# EAGLE board AQ_sensor_GSM (EAGLE 9.6.2)
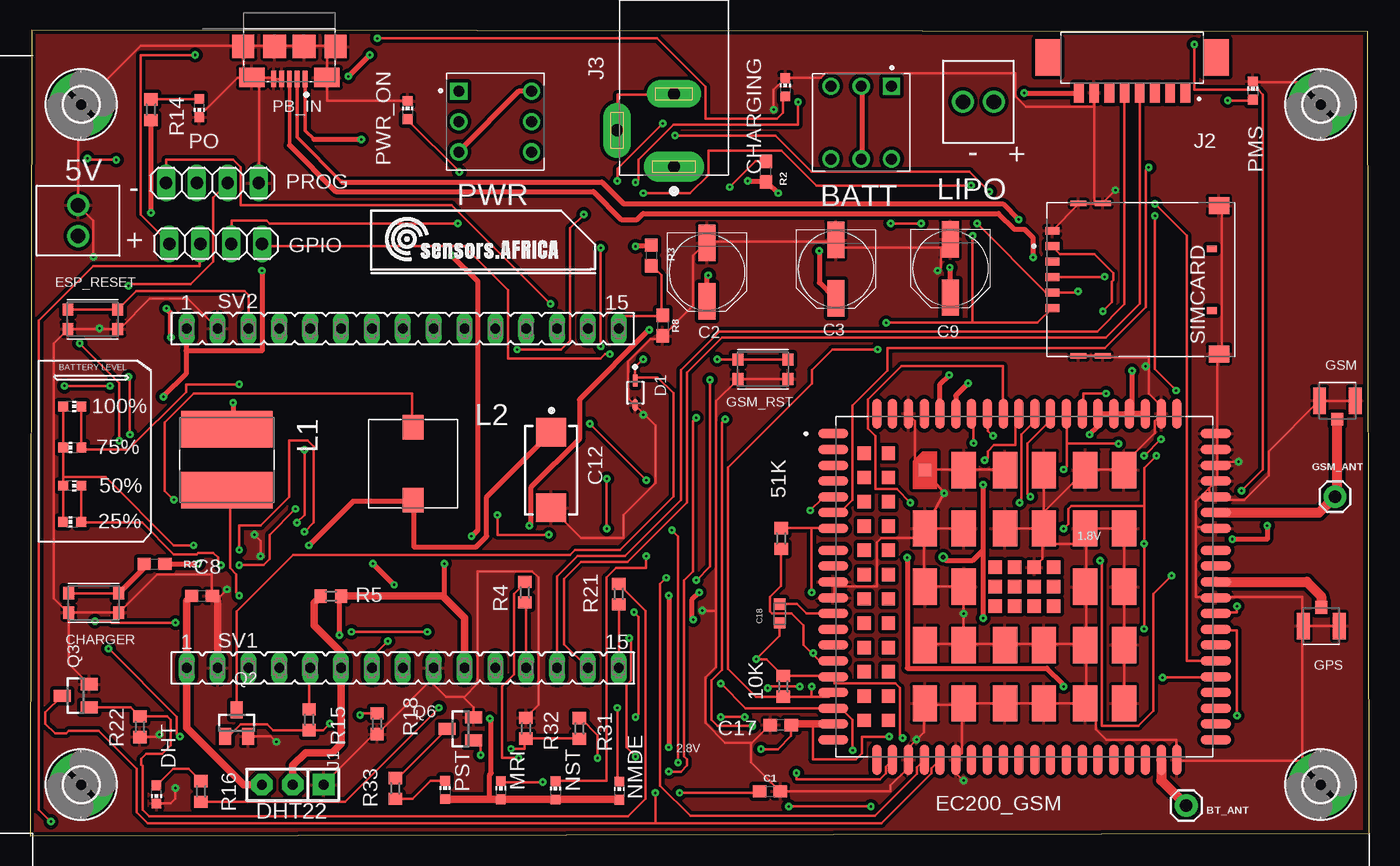
[diagram p5: board, top side]
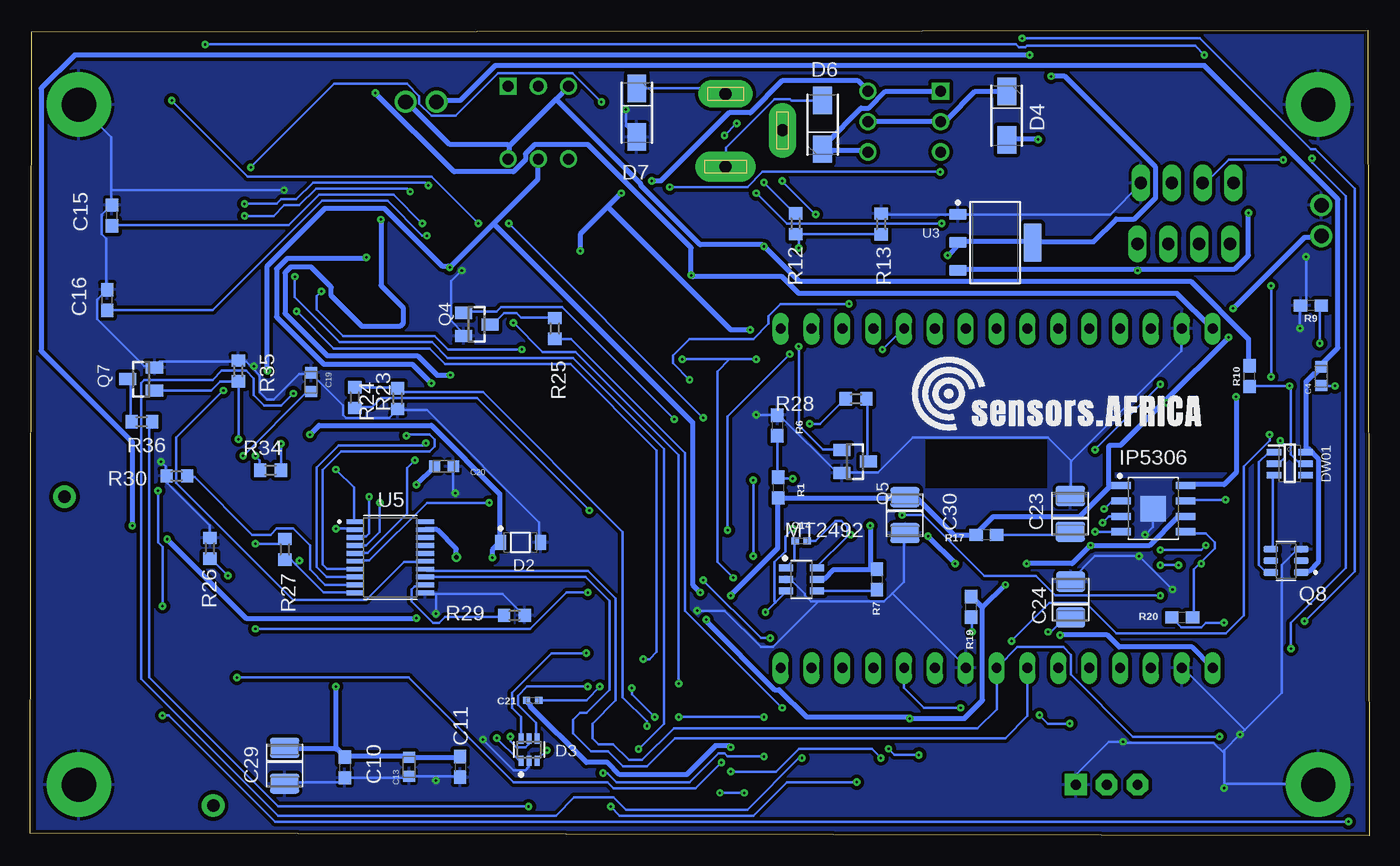
[diagram p6: board, bottom side, seen from below]

Size 110.2 x 66.3 mm. Coordinates in mm from the lower left corner, seen from the top.
Outline: 110.1,66.2 0.1,66.3 0,0 110.2,0.2 110.1,66.2
Copper layers (1*16): Top 0.035mm / dielectric 1.5mm / Bottom 0.035mm
Design rules "default *": minimum track width 0.1mm, minimum drill 0.15mm, track to track 0.3mm, track to pad 0.1mm, pad to pad 0.2mm, via to via 0.3mm, smd to smd 0.3mm, copper to edge 0.3mm, drill to drill 0.3mm, minimum pad ring 10mil, minimum via ring 8mil, stop-mask expansion 4mil, vias tented up to drill 0mil, thermal gap 10mil
Net classes: 0 default: width 0.2 mm, drill 0.2 mm, clearance 0.2 mm; 1 POWER: width 0.4 mm, drill 0.2 mm, clearance 0.2 mm to class 0, clearance 0.2 mm; 2 BGA: width 0.2 mm, drill 0.2 mm; 3 HCurrent: width 0.4 mm, drill 0.2 mm, clearance 0.2 mm to class 0

## Footprints (pad centres in the part's own frame; a part is rotated, then mirrored left to right if it is on the bottom)
TERMBLK_254-2N = drill 1.2: 1 0,0; 2 2.54,0
R0603 = smd 1 x 1.1: 1 -0.85,0; 2 0.85,0
CHIP-LED0603 = smd 0.8 x 0.8: A 0,-0.75; C 0,0.75
SW_TL2285EE = drill 0.9 square: 1 -2.5,-3 | drill 0.9: 2 0,-3; 3 2.5,-3; 4 -2.5,3; 5 0,3; 6 2.5,3
1X01 = drill 1.016 pad 1.88: 1 0,0
0603 = smd 1.1 x 1: 1 -0.85,0; 2 0.85,0
PANASONIC_D = smd 3 x 1.4: + 2.4,0; - -2.4,0
CAPC1608X90N = smd 0.92 x 0.98: 1 -0.775,0; 2 0.775,0
C0603 = smd 1.1 x 1: 1 -0.85,0; 2 0.85,0
CAPMP7343X430N = smd 2.35 x 2.45: 1 -3.1,0; 2 3.1,0
0402-TIGHT = smd 0.6 x 0.6: 1 -0.5,0; 2 0.5,0
CAP_TANT_B = smd 1.66 x 2.42: 1 -1.475,0; 2 1.475,0
SW_KMR621NGLFS = smd 0.9 x 1: 1_1 -2.05,0.8; 1_2 2.05,0.8; 2_1 -2.05,-0.8; 2_2 2.05,-0.8
ON_SEMI_1N4148WS_0 = smd 1.006 x 0.392: 1 -1,0; 2 1,0
ON_SEMICONDUCTOR_MMSZ5231BT1G_0 = smd 0.91 x 1.22: 1 -1.635,0; 2 1.635,0
SEMTECH_SMF05C_0 = smd 0.85 x 0.4: 1 -0.925,0.65; 2 -0.925,0; 3 -0.925,-0.65; 4 0.925,-0.65; 5 0.925,0; 6 0.925,0.65
DIOM5025X220N = smd 2.25 x 1.55: 1 -2,0; 2 2,0
SOT23-6L = smd 0.55 x 1.2: 1 -0.95,-1.3; 2 0,-1.3; 3 0.95,-1.3; 4 0.95,1.3; 5 0,1.3; 6 -0.95,1.3
XCVR_EC200UCNAB-N05-SNNSA = smd 2.5 x 0.8: 1 -15.75,12.6; 2 -15.75,11.3; 3 -15.75,10; 4 -15.75,8.7; 5 -15.75,7.4; 6 -15.75,6.1; 7 -15.75,4.8; 8 -15.75,0.4; 9 -15.75,-0.9; 10 -15.75,-2.2; 11 -15.75,-3.5; 12 -15.75,-4.8; 13 -15.75,-6.1; 14 -15.75,-7.4; 15 -15.75,-8.7; 16 -15.75,-10; 17 -15.75,-11.3; 18 -15.75,-12.6; 37 15.75,-12.6; 38 15.75,-11.3; 39 15.75,-10; 40 15.75,-8.7; 41 15.75,-7.4; 42 15.75,-6.1; 43 15.75,-4.8; 44 15.75,-3.5; 45 15.75,-2.2; 46 15.75,-0.9; 47 15.75,0.4; 48 15.75,4.8; 49 15.75,6.1; 50 15.75,7.4; 51 15.75,8.7; 52 15.75,10; 53 15.75,11.3; 54 15.75,12.6; 141 -15.75,3; 142 -15.75,1.7; 143 15.75,1.7; 144 15.75,3 | smd 0.8 x 2.5: 19 -9.55,-14.25; 20 -8.25,-14.25; 21 -6.95,-14.25; 22 -5.65,-14.25; 23 -4.35,-14.25; 24 -3.05,-14.25; 25 -1.75,-14.25; 26 -0.45,-14.25; 27 0.85,-14.25; 28 2.15,-14.25; 29 3.45,-14.25; 30 4.75,-14.25; 31 6.05,-14.25; 32 7.35,-14.25; 33 8.65,-14.25; 34 9.95,-14.25; 35 11.25,-14.25; 36 12.55,-14.25; 55 12.55,14.25; 56 11.25,14.25; 57 9.95,14.25; 58 8.65,14.25; 59 7.35,14.25; 60 6.05,14.25; 61 4.75,14.25; 62 3.45,14.25; 63 2.15,14.25; 64 0.85,14.25; 65 -0.45,14.25; 66 -1.75,14.25; 67 -3.05,14.25; 68 -4.35,14.25; 69 -5.65,14.25; 70 -6.95,14.25; 71 -8.25,14.25; 72 -9.55,14.25; 113 -10.85,14.25; 114 -12.15,14.25; 115 -10.85,-14.25; 116 -12.15,-14.25 | smd 1.1 x 1.1: 73 2.4,1.6; 74 2.4,0; 75 2.4,-1.6; 76 0.8,1.6; 77 0.8,0; 78 0.8,-1.6; 79 -0.8,1.6; 80 -0.8,0; 81 -0.8,-1.6; 82 -2.4,1.6; 83 -2.4,0; 84 -2.4,-1.6; 117 -11.2,11; 118 -11.2,9; 119 -11.2,7; 120 -11.2,5; 121 -11.2,3; 122 -11.2,1; 123 -11.2,-1; 124 -11.2,-3; 125 -11.2,-5; 126 -11.2,-7; 127 -11.2,-9; 128 -11.2,-11; 129 -13.2,11; 130 -13.2,9; 131 -13.2,7; 132 -13.2,5; 133 -13.2,3; 134 -13.2,1; 135 -13.2,-1; 136 -13.2,-3; 137 -13.2,-5; 138 -13.2,-7; 139 -13.2,-9; 140 -13.2,-11 | smd 2 x 3: 85 8.2,9.6; 86 8.2,4.8; 87 8.2,0; 88 8.2,-4.8; 89 8.2,-9.6; 90 5,9.6; 91 5,4.8; 92 5,0; 93 5,-4.8; 94 5,-9.6; 95 1.6,9.6; 96 1.6,4.8; 97 1.6,-4.8; 98 1.6,-9.6; 99 -1.6,9.6; 100 -1.6,4.8; 101 -1.6,-4.8; 102 -1.6,-9.6; 103 -5,9.6; 104 -5,4.8; 105 -5,0; 106 -5,-4.8; 107 -5,-9.6; 109 -8.2,4.8; 110 -8.2,0; 111 -8.2,-4.8; 112 -8.2,-9.6 | smd 1 x 1: 108 -8.2,9.6
1X04 = drill 1.016 long: 1 -3.81,0; 2 -1.27,0; 3 1.27,0; 4 3.81,0
TE_1909763-1 = smd 1 x 1.05: 1 0,-1.525 | smd 1.05 x 2.2: 2 -1.475,0; 3 1.475,0
2,8-PAD = drill 2.8 pad 5.334: B2,8 0,0
SOIC127P600X165-9T209N = smd 1.609 x 0.594: 1 -2.653,1.905; 2 -2.653,0.635; 3 -2.653,-0.635; 4 -2.653,-1.905; 5 2.653,-1.905; 6 2.653,-0.635; 7 2.653,0.635; 8 2.653,1.905 | smd 2.09 x 2.09: 9 0,0
SIP-100-03-32 = drill 0.813 pad 1.778 square: 1 -2.54,0 | drill 0.813 pad 1.778 octagon: 2 0,0; 3 2.54,0
MOLEX_53261-0871 = smd 0.8 x 1.6: 1 -4.375,2.9; 2 -3.125,2.9; 3 -1.875,2.9; 4 -0.625,2.9; 5 0.625,2.9; 6 1.875,2.9; 7 3.125,2.9; 8 4.375,2.9 | smd 2.1 x 3: S1 -6.925,0; S2 6.925,0
CUI_PJ-002BH = drill 1 pad 2.5 long: 1 0,0 | drill 1 pad 2.25 long: 2 6,0; 3 3,4.7
784787047 = smd 7.5 x 3: 1 0,2.5; 2 0,-2.5
784778010 = smd 1.7 x 2: 1 0,3; 2 0,-3
SOT95P280X145-6N = smd 1.172 x 0.589: 1 -1.272,0.95; 2 -1.272,0; 3 -1.272,-0.95; 4 1.272,-0.95; 5 1.272,0; 6 1.272,0.95
AMPHENOL_10118192-0001LF = smd 0.4 x 1.35: 1 -1.3,0; 2 -0.65,0; 3 0,0; 4 0.65,0; 5 1.3,0 | smd 2.1 x 1.6: SH1 -3.1,-0.125; SH2 3.1,-0.125 | smd 1.8 x 1.9: SH3 -3.8,-2.675; SH6 3.8,-2.675 | smd 1.9 x 1.9: SH4 -1.2,-2.675; SH5 1.2,-2.675
SOT23-BEC = smd 1 x 1.4: B -0.95,-1.1; C 0,1.1; E 0.95,-1.1
SOT95P280X145-6N' = smd 1.21 x 0.59: 1 -1.255,0.95; 2 -1.255,0; 3 -1.255,-0.95; 4 1.255,-0.95; 5 1.255,0; 6 1.255,0.95
MOLEX_78646-3001 = smd 1.15 x 0.65: C1 -7.295,2.755; C2 -7.295,0.215; C3 -7.295,-2.325; C5 -7.295,4.025; C6 -7.295,1.485; C7 -7.295,-1.055 | smd 1.3 x 0.45: G1 -5.125,6.27; G2 -3.125,6.27; G3 -5.125,-6.27; G4 -3.125,-6.27 | smd 1.7 x 1.4: G5 6.435,-6.105; G6 6.435,6.105 | smd 0.8 x 0.54: X1 5.855,2.54; X2 5.855,-2.54
FE15 = drill 0.813 long: 1 -17.78,0; 2 -15.24,0; 3 -12.7,0; 4 -10.16,0; 5 -7.62,0; 6 -5.08,0; 7 -2.54,0; 8 0,0; 9 2.54,0; 10 5.08,0; 11 7.62,0; 12 10.16,0; 13 12.7,0; 14 15.24,0; 15 17.78,0
TEXAS_INSTRUMENTS_LM1117IMP-3.3-NOPB_0 = smd 1.45 x 0.9: 1 -3.075,2.3; 2 -3.075,0; 3 -3.075,-2.3 | smd 1.45 x 3.15: 4 3.075,0
SOP65P640X120-20N = smd 1.57 x 0.41: 1 -2.87,2.925; 2 -2.87,2.275; 3 -2.87,1.625; 4 -2.87,0.975; 5 -2.87,0.325; 6 -2.87,-0.325; 7 -2.87,-0.975; 8 -2.87,-1.625; 9 -2.87,-2.275; 10 -2.87,-2.925; 11 2.87,-2.925; 12 2.87,-2.275; 13 2.87,-1.625; 14 2.87,-0.975; 15 2.87,-0.325; 16 2.87,0.325; 17 2.87,0.975; 18 2.87,1.625; 19 2.87,2.275; 20 2.87,2.925

## Placement (x,y rotation side)
5V  2828XX-2282834-2  [TERMBLK_254-2N]  3.93,49.37 90 top
10K  4.7K  [R0603]  61.97,12.29 90 top
25%  ORANGE  [CHIP-LED0603]  3.44,25.83 90 top
50%  ORANGE  [CHIP-LED0603]  3.46,28.8 270 top
51K  4.7K  [R0603]  61.79,24.46 90 top
75%  ORANGE  [CHIP-LED0603]  3.46,31.96 90 top
100%  ORANGE  [CHIP-LED0603]  3.46,35.34 270 top
BATT  TL2285EE  [SW_TL2285EE]  68.39,58.71 180 top
BT_ANT  [1X01]  95.14,2.48 180 top
C1  10nF  [0603]  60.88,3.64 0 top
C2  100uF  [PANASONIC_D]  55.68,46.39 270 top
C3  100uF  [PANASONIC_D]  66.3,46.65 270 top
C4  100nf  [CAPC1608X90N]  3.94,37.82 90 bottom
C8  10uF  [C0603]  14.13,19.74 0 top
C9  100uF  [PANASONIC_D]  75.72,46.7 270 top
C10  33pF  [C0603]  84.31,5.61 270 bottom
C11  10pF  [C0603]  74.82,5.66 270 bottom
C12  470uf  [CAPMP7343X430N]  42.85,30.1 270 top
C13  100nf  [CAPC1608X90N]  79.03,5.67 90 bottom
C14  22nF  [0402-TIGHT]  46.75,24.27 0 bottom
C15  33pF  [C0603]  103.49,51.07 90 bottom
C16  33pF  [C0603]  103.87,44.09 90 bottom
C17  33pF  [C0603]  61.77,9.1 180 top
C18  100nf  [CAPC1608X90N]  61.68,18.29 270 top
C19  100nf  [CAPC1608X90N]  87.08,37.33 270 bottom
C20  100nf  [CAPC1608X90N]  76.16,30.41 180 bottom
C21  22pF  [0402-TIGHT]  68.86,11.15 0 bottom
C23  TAJB106K016RNJ  [CAP_TANT_B]  24.6,26.49 90 bottom
C24  TAJB106K016RNJ  [CAP_TANT_B]  24.57,19.43 90 bottom
C29  TAJB106K016RNJ  [CAP_TANT_B]  89.27,5.75 270 bottom
C30  TAJB106K016RNJ  [CAP_TANT_B]  38.21,26.39 270 bottom
CHARGER  KMR621NGLFS  [SW_KMR621NGLFS]  5.22,19.16 0 top
CHARGING  ORANGE  [CHIP-LED0603]  62.14,61.62 0 top
D1  ON_SEMI_1N4148WSON_SEMI_1N4148WS_0_0  [ON_SEMI_1N4148WS_0]  49.79,36.47 270 top
D2  ON_SEMICONDUCTOR_MMSZ5231BT1GON_SEMICONDUCTOR_MMSZ5231BT1G_0_0  [ON_SEMICONDUCTOR_MMSZ5231BT1G_0]  69.86,24.14 0 bottom
D3  SEMTECH_SMF05CSEMTECH_SMF05C_0_0  [SEMTECH_SMF05C_0]  69.15,7.08 90 bottom
D4  SS54-HF  [DIOM5025X220N]  29.82,59.28 270 bottom
D6  SS54-HF  [DIOM5025X220N]  44.99,58.52 90 bottom
D7  SS54-HF  [DIOM5025X220N]  60.29,59.52 270 bottom
DHT  GREEN  [CHIP-LED0603]  10.39,3.4 180 top
DW01  DW01-P  [SOT23-6L]  6.54,30.62 270 bottom
EC200_GSM  EC200UCNAB-N05-SNNSA  [XCVR_EC200UCNAB-N05-SNNSA]  81.83,20.49 0 top
ESP_RESET  KMR621NGLFS  [SW_KMR621NGLFS]  5.14,42.52 180 top
GPIO  PINHD-1X4  [1X04]  15.25,48.73 0 top
GPS  1909763-1  [TE_1909763-1]  106.26,17.26 180 top
GSM  1909763-1  [TE_1909763-1]  107.59,35.81 0 top
GSM_ANT  [1X01]  107.39,27.9 180 top
GSM_RST  KMR621NGLFS  [SW_KMR621NGLFS]  60.31,38.4 180 top
H1  MOUNT-PAD-ROUND2.8  [2,8-PAD]  4.2,60.2 180 top
H2  MOUNT-PAD-ROUND2.8  [2,8-PAD]  4.2,4.2 180 top
H3  MOUNT-PAD-ROUND2.8  [2,8-PAD]  106.2,4.2 180 top
H4  MOUNT-PAD-ROUND2.8  [2,8-PAD]  106.2,60.2 180 top
IP5306  IP5306  [SOIC127P600X165-9T209N]  17.77,26.92 0 bottom
J1  F-1X03-SIP-100-32  [SIP-100-03-32]  21.6,4.2 180 top
J2  53261-0871  [MOLEX_53261-0871]  90.69,64.06 180 top
J3  PJ-002BH  [CUI_PJ-002BH]  52.98,55.07 90 top
L1  784787047  [784787047]  16.18,30.94 180 top
L2  784778010  [784778010]  31.51,30.62 0 top
LIPO  2828XX-2282834-2  [TERMBLK_254-2N]  79.31,60.42 180 top
MRI  ORANGE  [CHIP-LED0603]  38.73,3.75 0 top
MT2492  MT2492  [SOT95P280X145-6N]  46.73,21.1 0 bottom
NMDE  ORANGE  [CHIP-LED0603]  48.47,3.69 0 top
NST  ORANGE  [CHIP-LED0603]  43.22,3.73 0 top
PB_IN  10118192-0001LF  [AMPHENOL_10118192-0001LF]  21.32,62.3 180 top
PMS  ORANGE  [CHIP-LED0603]  100.63,61.35 0 top
PO  RED  [CHIP-LED0603]  13.91,59.91 180 top
PROG  PINHD-1X4  [1X04]  14.98,53.74 0 top
PST  ORANGE  [CHIP-LED0603]  34.13,3.76 0 top
PWR  TL2285EE  [SW_TL2285EE]  38.27,58.79 270 top
PWR_ON  ORANGE  [CHIP-LED0603]  31.05,59.73 0 top
Q2  MMBT2222  [SOT23-BEC]  16.98,9.28 0 top
Q3  MMBT2222  [SOT23-BEC]  3.73,11.52 90 top
Q4  MMBT2222  [SOT23-BEC]  73.45,42.09 270 bottom
Q5  MMBT2222  [SOT23-BEC]  42.31,30.8 270 bottom
Q6  MMBT2222  [SOT23-BEC]  35.4,8.79 90 top
Q7  MMBT2222  [SOT23-BEC]  101.09,37.58 90 bottom
Q8  FS8205  [SOT95P280X145-6N']  6.84,22.62 180 bottom
R1  110k  [0603]  48.63,28.66 270 bottom
R2  1k  [0603]  60.54,54.67 90 top
R3  47k  [0603]  51.1,47.77 270 top
R4  470R  [R0603]  40.71,20.04 270 top
R5  4.7K  [R0603]  24.74,19.72 180 top
R6  15k  [0603]  48.72,33.77 270 bottom
R7  10k  [0603]  40.5,21.09 90 bottom
R8  10k  [0603]  52.05,41.99 270 top
R9  1k  [0603]  4.79,43.65 180 bottom
R10  100R  [0603]  9.84,37.82 90 bottom
R12  4.7K  [R0603]  47.21,50.39 270 bottom
R13  47K  [R0603]  40.16,50.36 270 bottom
R14  1K  [R0603]  9.93,59.76 270 top
R15  4.7K  [R0603]  22.94,9.54 270 top
R16  470R  [R0603]  14.05,3.65 270 top
R17  2R  [0603]  31.51,24.76 180 bottom
R18  47K  [R0603]  28.54,9.21 90 top
R19  2R  [0603]  32.76,18.83 90 bottom
R20  220R  [0603]  15.39,17.98 0 bottom
R21  4.7K  [R0603]  48.42,19.88 90 top
R22  47K  [R0603]  9.02,8.96 90 top
R23  4.7K  [R0603]  83.5,36.07 90 bottom
R24  47K  [R0603]  79.98,35.98 90 bottom
R25  470R  [R0603]  67.03,41.76 270 bottom
R26  120K  [R0603]  95.41,23.66 90 bottom
R27  10K  [R0603]  89.25,23.57 270 bottom
R28  470R  [R0603]  42.24,35.96 180 bottom
R29  51K  [R0603]  70.35,18.13 0 bottom
R30  51K  [R0603]  98.14,29.61 180 bottom
R31  4.7K  [R0603]  45.2,8.82 270 top
R32  47K  [R0603]  40.8,8.84 270 top
R33  470R  [R0603]  30.03,3.89 270 top
R34  4.7K  [R0603]  90.43,30.08 180 bottom
R35  47K  [R0603]  93.09,38.26 270 bottom
R36  470R  [R0603]  101.02,34.07 0 bottom
R37  10k  [0603]  10.22,22.36 0 top
SIMCARD  78646-3001  [MOLEX_78646-3001]  91.4,45.77 0 top
SV1  [FE15]  30.66,13.8 0 top
SV2  [FE15]  30.66,41.74 0 top
U3  TEXAS_INSTRUMENTS_LM1117IMP-3.3-NOPBTEXAS_INSTRUMENTS_LM1117IMP-3.3-NOPB_0_0  [TEXAS_INSTRUMENTS_LM1117IMP-3.3-NOPB_0]  30.77,48.83 0 bottom
U5  TXS0108EPWR  [SOP65P640X120-20N]  80.58,22.92 0 bottom

## Tracks (layer width: path | path; a pad name or v marks a point on that pad's centre or on a via)
4.5-16V  (via drill 0.2)
  Top 0.4: v59.06,53.9 60.44,53.9 R2.1 60.69,53.77 v61.56,52.9 | PWR.3 35.31,56.4 40.19,61.27 41.19,61.27 PWR.4 | v64.94,48.15 64.94,45.52 66.19,44.27 C3.+ | v41.06,25.52 41.19,25.65 41.19,28.65 45.19,32.65 45.19,35.9 v50.94,41.65
  Bottom 0.4: 41.06,21.9 44.06,21.9 44.81,21.15 45.44,21.15 MT2492.5 | 41.06,21.9 40.56,21.9 R7.2 | v59.06,53.9 58.31,53.9 52.69,59.52 50.94,59.52 48.31,62.15 42.06,62.15 41.31,61.4 PWR.4 | v64.94,48.15 64.94,49.52 62.69,51.77 | v61.56,52.9 62.69,51.77 | v41.06,25.52 41.06,21.9 | v50.94,41.65 52.56,41.65 62.69,51.77
5V_IN  (via drill 0.2)
  Top 0.4: v52.56,19.77 v52.56,7.27 | v11.19,43.4 11.56,43.02 v11.56,41.02 | v16.69,35.65 16.69,34.02 16.19,33.52 L1.2
  Bottom 0.4: v52.56,7.27 52.69,7.4 53.81,7.4 56.19,5.02 61.69,5.02 62.69,6.02 64.44,6.02 69.06,10.65 69.06,10.77 69.31,11.02 C21.1 | v52.56,19.77 48.69,23.65 48.69,27.77 R1.2 48.44,27.77 38.31,27.77 C30.1 38.19,27.77 37.19,27.77 34.19,24.77 32.44,24.77 R17.2 32.31,24.9 30.94,26.27 23.81,26.27 21.31,28.77 | 21.31,28.77 20.44,28.77 IP5306.1 | v11.19,43.4 5.31,49.27 3.94,49.27 5V.1 | 16.81,35.77 20.44,32.15 21.31,32.15 21.44,32.02 21.44,28.9 21.31,28.77 | 16.81,35.77 v11.56,41.02 | v16.69,35.65 16.81,35.77
5V_OUT  (via drill 0.2)
  Top 0.4: v81.81,61.15 86.19,61.15 J2.8 | v55.81,46.15 55.69,46.02 55.69,44.02 C2.+ | v10.94,36.15 12.81,38.02 12.81,39.9 | 12.81,39.9 12.81,41.65 SV2.1 | v9.94,51.27 9.94,58.9 R14.2 | 12.81,39.9 19.06,39.9 v19.06,46.52
  Bottom 0.4: v81.81,61.15 75.31,54.65 70.44,54.65 69.44,55.65 69.44,56.15 68.69,56.9 64.31,56.9 55.81,48.4 v55.81,46.15 55.69,46.02 48.31,46.02 46.94,44.65 15.81,44.65 12.94,41.77 SV2.1 | v10.94,36.15 10.94,29.9 11.94,28.9 15.06,28.9 IP5306.8 | v9.94,51.27 9.94,47.77 11.06,46.65 19.06,46.65 | 19.06,46.65 33.81,46.65 U3.3 | v19.06,46.52 19.06,46.65
5VT
  Bottom 0.4: D4.1 29.94,61.27 32.44,61.27 34.69,59.02 PWR.2 35.81,58.77 41.19,58.77 PWR.5
+3V3  (via drill 0.2, 0.35)
  Top 0.4: v25.44,16.52 25.44,19.52 R5.1 | v78.44,17.9 78.44,23.52 | 78.44,23.52 v78.44,28.9 | v98.94,24.4 101.81,24.4 v101.81,25.52 | v26.19,62.52 v27.94,64.27 | v34.06,22.4 34.06,19.9 33.94,19.72 | v36.31,24.65 36.81,25.15 36.81,45.65 v34.69,47.77 | 78.44,23.52 77.54,22.62 75.44,22.62 v75.14,22.92
  Top 0.6: C8.1 12.88,19.34 SV1.1 12.88,8.88 17.56,4.2 J1.3 | R5.1 33.94,19.72 35.74,17.92 SV1.10
  Bottom 0.4: v25.44,16.52 21.56,16.52 20.56,15.52 14.56,15.52 12.94,13.9 SV1.1 | v78.44,28.9 76.94,30.4 C20.2 | v78.44,17.9 92.44,17.9 v98.94,24.4 | v101.81,25.52 101.81,32.4 109.31,39.9 109.31,61.52 106.56,64.27 v27.94,64.27 | v26.19,62.52 25.06,62.52 17.56,55.02 17.56,52.52 19.31,50.77 20.81,50.77 22.69,48.9 27.69,48.9 U3.4 27.81,48.9 33.81,48.9 U3.2 33.81,48.65 v34.69,47.77 | v36.31,24.65 v34.06,22.4 | v75.14,22.92 75.14,23.6 76.73,25.19 U5.19
BATT-
  Bottom 0.4: 5.19,31.9 5.19,31.65 DW01.6 | 5.19,31.9 5.19,37.4 4.56,38.02 4.44,38.02 3.94,38.52 C4.2 3.94,38.77 2.56,40.15 2.56,52.4 13.56,63.4 71.94,63.4 74.81,60.52 76.69,60.52 LIPO.2 | Q8.1 5.56,21.77 4.94,21.77 4.19,22.52 4.19,31.02 5.06,31.9 5.19,31.9
BMSV
  Top 0.2: SV2.15 48.44,41.77 48.44,42.77 51.94,42.77 R8.1 51.94,42.9 51.94,46.15 51.19,46.9 R3.2
BT_ANT
  Top 0.813: EC200_GSM.35 93.08,4.54 BT_ANT.1
DHT_LED  (via drill 0.2)
  Top 0.2: R16.2 25.91,2.8 v33.64,10.52
  Bottom 0.2: v33.64,10.52 36.64,10.52 38.28,12.16 SV1.11
DHT_OUT
  Top 0.6: R5.2 23.34,19.17 23.34,17.32 25.58,15.08 SV1.6 25.58,7.56 24.84,6.82 22.64,6.82 21.6,5.78 J1.2
ESP_RST
  Top 0.2: SV2.3 17.96,44.5 17.64,44.82 8.7,44.82 ESP_RESET.2_1 ESP_RESET.2_2
G_ADC0  (via drill 0.2)
  Top 0.2: v99.31,18.9 99.31,18.4 97.69,18.4 EC200_GSM.45 | v99.69,28.4 101.44,30.15 101.44,61.02 101.06,61.4 95.81,61.4 v95.81,65.15 | v13.56,64.27 9.06,64.27 9.06,51.15 11.44,48.77 GPIO.1
  Bottom 0.2: v99.31,18.9 99.31,23.77 99.69,24.15 v99.69,28.4 | v95.81,65.15 29.06,65.15 28.81,64.9 28.31,64.9 28.19,65.02 14.31,65.02 v13.56,64.27
G_ADC1  (via drill 0.2)
  Top 0.2: v99.31,9.9 99.31,16.9 97.69,16.9 EC200_GSM.44 | v1.69,1.15 0.69,2.15 0.69,42.4 5.19,46.9 13.94,46.9 13.94,48.65 GPIO.2
  Bottom 0.2: v99.31,9.9 98.81,9.9 90.06,1.15 v1.69,1.15
G_I2C_SCL  (via drill 0.2)
  Top 0.2: v93.19,13.02 97.56,13.02 EC200_GSM.41 | v53.31,6.02 53.31,24.65 v52.81,25.15 | v47.69,39.65 47.31,39.65 46.94,39.27 39.31,39.27 39.31,44.9 35.69,48.52 19.19,48.52 19.19,48.65 GPIO.4
  Bottom 0.2: v93.19,13.02 79.06,13.02 70.44,4.4 62.69,4.4 62.19,3.9 55.44,3.9 v53.31,6.02 | v52.81,25.15 52.81,34.52 v47.69,39.65
G_I2C_SDA  (via drill 0.2)
  Top 0.2: v92.56,52.02 95.19,49.4 95.19,14.4 97.56,14.4 EC200_GSM.42 | v77.44,53.52 64.69,53.52 61.81,56.4 55.81,56.4 55.81,54.4 54.31,52.9 v50.44,52.9 | v35.19,50.4 19.69,50.4 19.44,50.65 16.56,50.65 16.56,48.77 GPIO.3
  Bottom 0.2: v92.56,52.02 89.94,52.02 89.56,52.4 88.31,52.4 86.94,53.77 77.69,53.77 v77.44,53.52 | v50.44,52.9 47.94,50.4 v35.19,50.4
G_USB_BOOT  (via drill 0.2)
  Top 0.2: v63.06,5.15 63.06,4.65 69.94,4.65 70.44,5.15 70.44,5.65 70.94,6.15 EC200_GSM.115 | v49.81,6.52 49.06,7.27 49.06,12.4 49.44,12.77 49.44,16.15 v49.31,16.27 | v54.81,21.02 55.94,22.15 v55.94,37.52 | v42.81,43.77 34.69,51.9 17.31,51.9 17.31,55.02 16.69,55.65 11.19,55.65 11.19,53.77 PROG.1
  Bottom 0.2: v63.06,5.15 62.69,5.15 61.94,4.4 55.94,4.4 53.56,6.77 53.06,6.77 52.81,6.52 v49.81,6.52 | v49.31,16.27 50.06,16.27 v54.81,21.02 | v55.94,37.52 57.31,38.9 57.31,39.52 55.94,40.9 50.69,40.9 49.44,42.15 49.44,42.77 48.44,43.77 v42.81,43.77
G_USB_D+  (via drill 0.2)
  Top 0.305: PB_IN.3 21.32,56.84
  Top 0.4: v82.54,47.62 82.54,49.22 81.84,49.92 81.01,49.92 79.7,51.22 50.44,51.22 49.94,50.72 48.64,50.72 46.34,53.02 25.14,53.02 21.32,56.84 | v77.21,37.25 76.18,36.23 EC200_GSM.69
  Bottom 0.4: v77.21,37.25 78.77,38.82 86.06,38.82 89.94,42.71 89.94,46.65 89.06,47.53 82.64,47.53 v82.54,47.62
G_USB_D-  (via drill 0.2)
  Top 0.305: PB_IN.2 21.97,57.49 25.64,53.82
  Top 0.4: 25.64,53.82 47.04,53.82 48.84,52.02 80.04,52.02 v81.34,50.72 | EC200_GSM.70 74.88,37.16 v75.64,37.92
  Bottom 0.4: v81.34,50.72 81.34,45.29 79.54,43.49 79.54,42.16 79.77,41.92 82.9,41.92 85.44,44.45 85.44,45.16 87.11,46.83 88.77,46.83 89.24,46.36 89.24,43 85.77,39.52 78.34,39.52 76.74,37.92 v75.64,37.92
GND  (via drill 0.2)
  Top 0.2: 35.64,11.42 34.24,11.42 33.2,12.46 SV1.9 33.19,13.02 28.56,8.4 R18.1 28.44,8.27 28.19,8.27 24.19,4.27 J1.1 | 35.64,11.42 36.5,10.56 Q6.E | CHARGER.2_1 3.17,14.13 Q3.E | CHARGER.2_1 CHARGER.2_2 7.31,18.4 10.44,21.52 14.94,21.52 14.94,20.02 C8.2 | R22.1 10.43,8.12 v10.64,8.32 | v11.94,3.92 11.94,3.02 11.57,2.65 DHT.C | Q2.E 19.78,8.18 v20.24,7.72 | SV2.2 12.94,44.22 9.84,44.22 7.34,41.72 ESP_RESET.1_1 5.69,41.72 | 5.69,41.72 ESP_RESET.1_2 3.06,41.65 1.94,40.52 1.94,19.52 3.06,18.4 CHARGER.2_1 | GSM_RST.1_1 GSM_RST.1_2 58.19,37.52 56.44,35.77 56.44,18.52 | v61.19,59.77 61.19,61.4 62.06,62.27 CHARGING.C 62.19,62.4 65.06,62.4 65.44,62.77 81.06,62.77 81.06,60.9 81.94,60.02 87.56,60.02 | SIMCARD.C5 84.19,49.9 86.19,51.9 86.19,52.02 SIMCARD.G1 86.31,52.02 87.56,52.02 | 87.56,52.02 88.19,52.02 SIMCARD.G2 88.31,52.15 v89.31,53.15 | 87.56,52.02 87.56,60.02 | 87.56,60.02 J2.7 | PMS.C 100.69,62.02 106.19,62.02 106.19,60.27 H4.B2,8 | 59.38,7.58 60.81,9.02 C17.2 | 59.38,7.58 59.31,7.52 59.31,6.02 61.69,3.65 C1.2 61.81,3.65 70.81,3.65 70.81,4.15 72.19,5.52 72.19,6.15 EC200_GSM.19 72.31,6.27 72.31,7.27 v72.94,7.9 73.56,8.52 73.56,10.77 EC200_GSM.112 73.69,10.77 76.69,10.77 EC200_GSM.107 | 56.44,18.52 56.44,13.9 55.56,13.02 55.56,9.27 57.19,7.65 59.31,7.65 59.38,7.58 | EC200_GSM.108 75.09,28.39 75.09,28.32 v75.21,28.2 75.09,28.2 75.09,27.95 EC200_GSM.109 | EC200_GSM.108 73.69,30.15 76.81,30.15 EC200_GSM.103 76.94,30.15 80.19,30.15 EC200_GSM.99 | EC200_GSM.72 72.31,34.65 72.81,34.15 72.81,30.9 73.56,30.15 EC200_GSM.108 | 66.19,20.52 66.19,20.77 EC200_GSM.8 66.19,20.52
  Top 0.2: 66.19,20.52 66.19,19.65 EC200_GSM.9 | 66.19,20.52 69.69,20.52 69.69,24.15 70.06,24.52 73.56,24.52 | 73.56,24.52 73.56,25.27 EC200_GSM.109 | EC200_GSM.104 76.81,25.27 73.69,25.27 EC200_GSM.109 | 73.56,24.52 73.56,20.52 EC200_GSM.110 73.69,20.52 76.81,20.52 EC200_GSM.105 76.81,20.4 v76.81,18.27 76.81,15.77 | 73.56,24.52 EC200_GSM.109 | SIMCARD.G3 86.31,39.52 88.19,39.52 SIMCARD.G4 88.31,39.4 92.06,39.4 92.06,38.65 | 92.06,38.65 92.06,36.4 93.06,35.4 93.06,34.77 EC200_GSM.56 93.06,34.65 92.56,34.15 92.56,33.15 90.06,30.65 90.06,30.15 EC200_GSM.85 89.94,30.15 86.94,30.15 EC200_GSM.90 86.81,30.02 83.44,26.65 | 83.31,25.27 83.31,24.02 | 83.31,24.02 83.31,22.77 82.69,22.15 EC200_GSM.76 | 83.31,25.27 80.31,25.27 EC200_GSM.100 | 83.31,25.27 EC200_GSM.96 | 83.44,26.65 83.44,25.4 EC200_GSM.96 | 83.44,26.65 83.44,30.02 EC200_GSM.95 | 83.44,26.65 EC200_GSM.96 | EC200_GSM.94 86.81,10.9 EC200_GSM.98 83.31,10.9 80.31,10.9 EC200_GSM.102 80.19,10.9 76.94,10.9 EC200_GSM.107 | EC200_GSM.107 76.81,10.77 76.69,10.65 76.69,6.77 76.19,6.27 EC200_GSM.22 76.19,6.15 76.19,5.15 v76.81,4.52 | EC200_GSM.89 90.06,10.9 90.06,15.65 EC200_GSM.88 90.06,15.77 90.06,20.4 EC200_GSM.87 90.06,20.52 90.06,25.27 EC200_GSM.86 89.94,25.27 86.94,25.27 | 76.81,15.77 73.69,15.77 EC200_GSM.111 | EC200_GSM.93 86.81,15.77 83.44,15.77 EC200_GSM.97 83.31,15.77 80.31,15.77 EC200_GSM.101 80.19,15.77 76.94,15.77 EC200_GSM.106 76.81,15.77 | EC200_GSM.93 86.94,15.77 86.94,20.4 EC200_GSM.92 86.94,20.52 86.94,24.02 | 86.94,24.02 86.94,25.27 | 86.94,25.27 EC200_GSM.91 86.94,24.02 | EC200_GSM.94 86.94,10.9 86.94,15.65 EC200_GSM.93
  Top 0.2: 86.94,24.02 83.31,24.02 | 83.31,24.02 EC200_GSM.96 | 104.69,6.15 106.19,6.15 106.19,4.27 H3.B2,8 104.69,6.15 | 104.69,6.15 94.44,6.15 EC200_GSM.36 94.31,6.27 94.31,7.9 88.56,7.9 87.69,8.77 87.69,10.02 86.94,10.77 EC200_GSM.94 | SIMCARD.G6 97.94,51.77 98.06,51.65 98.06,39.9 97.94,39.77 SIMCARD.G5 97.81,39.65 97.69,39.52 97.69,33.15 EC200_GSM.54 97.69,33.02 97.69,31.9 EC200_GSM.53 97.69,31.77 97.69,30.77 | GPS.3 104.81,17.27 107.69,17.27 GPS.2 | GPS.3 104.69,17.27 104.69,19.65 97.69,19.65 EC200_GSM.46 97.56,19.65 95.94,19.65 95.94,25.4 | GSM.3 109.06,35.77 106.19,35.77 GSM.2 106.06,35.77 101.94,31.65 101.94,29.65 99.94,27.65 97.69,27.65 97.69,27.77 EC200_GSM.50 97.56,27.9 97.06,28.4 97.06,28.52 97,28.58 | 95.94,25.4 97.56,25.4 EC200_GSM.48 | 95.94,25.4 95.94,27.52 97,28.58 | 97,28.58 97.56,29.15 EC200_GSM.51 97.69,29.27 97.69,30.4 EC200_GSM.52 | 97.69,30.77 v99.44,30.77 | 97.69,30.77 97.69,30.52 EC200_GSM.52 | 97.69,30.77 EC200_GSM.52 | 104.69,6.15 104.69,17.15 GPS.3 | 92.06,38.65 v91.81,38.65 | R32.1 40.81,9.77 41.81,10.77 41.81,21.27 41.31,21.77 36.81,21.77 36.81,12.52 35.69,11.4 35.64,11.42 | v18.44,24.77 18.94,24.27 v18.94,23.02 | v16.19,20.27 15.56,19.65 15.56,19.52 15.42,19.3 | PWR_ON.C 30.94,60.52 24.44,60.52 24.44,62.4 PB_IN.SH1 24.44,62.52 24.44,65.02 | PB_IN.SH6 17.56,65.02 20.06,65.02 PB_IN.SH5 20.19,65.02 22.44,65.02 PB_IN.SH4 22.56,65.02 24.44,65.02 | 24.44,65.02 25.06,65.02 PB_IN.SH3 24.44,65.02 | PB_IN.4 20.56,62.27 20.06,62.27 PB_IN.5 19.94,62.4 18.81,62.4 | 17.56,62.4 18.19,62.4 PB_IN.SH2 | 17.56,62.4 17.06,62.4 13.94,59.27 PO.C | 18.81,62.4 18.31,62.4 PB_IN.SH2
  Top 0.2: 18.81,62.4 18.81,53.77 PROG.4 | 18.81,62.4 PB_IN.SH2 | 17.56,62.4 17.56,64.9 PB_IN.SH6 | 17.56,62.4 PB_IN.SH2 | PB_IN.SH6 17.44,65.02 9.06,65.02 4.31,60.27 H1.B2,8 4.19,60.15 3.94,59.9 3.94,52.02 5V.2 5.19,50.65 v5.19,47.65 | v5.69,41.77 5.69,41.72 | 50.5,34.71 49.81,35.4 D1.2 49.69,35.52 49.19,36.02 49.19,39.02 51.06,40.9 51.94,40.9 51.94,41.02 R8.2 52.06,41.15 54.56,43.65 54.56,47.77 55.56,48.77 C2.- 55.69,48.9 66.19,48.9 | 50.5,34.71 51.44,33.77 51.44,29.02 48.81,26.4 48.81,24.52 45.31,24.52 42.94,26.9 C12.2 | v50.44,34.65 50.5,34.71 | v74.69,46.52 74.94,46.77 74.94,48.27 75,48.33 | 75,48.33 75.69,49.02 C9.- | 66.19,48.9 66.19,49.02 C3.- 66.19,48.9 | 66.19,48.9 66.19,48.4 74.94,48.4 75,48.33 | v55.31,18.52 56.44,18.52
  Top 0.6: C8.2 15.42,19.3 SV1.2
  Bottom 0.2: 11.94,6.77 11.94,7.02 v10.64,8.32 10.25,8.71 | 11.94,6.77 11.94,4.27 | 11.94,4.27 v11.94,3.92 | J1.1 24.14,5.02 21.44,7.72 v20.24,7.72 20.19,7.65 12.81,7.65 11.94,6.77 | v61.19,59.77 61.19,58.4 60.31,57.52 D7.2 | D2.2 68.31,24.15 68.31,25.77 77.56,35.02 79.94,35.02 R24.1 80.06,35.02 80.69,34.4 84.19,34.4 84.44,34.65 84.44,35.4 87.06,38.02 C19.1 87.19,38.02 88.06,38.02 90.19,35.9 90.69,35.9 91.31,36.52 91.31,37.9 91.88,38.46 | 103.56,53.15 103.56,57.52 106.19,60.15 H4.B2,8 | 103.56,53.15 103.56,52.02 C15.2 103.56,51.9 104.31,51.15 104.31,49.52 103.94,49.15 103.94,45.02 C16.2 103.94,44.9 104.69,44.15 104.69,42.52 100.81,38.65 100.06,38.65 Q7.E 99.94,38.65 99.56,39.02 93.19,39.02 R35.1 93.06,39.02 92.44,39.02 91.88,38.46 | 103.56,53.15 v89.31,53.15 | C20.1 75.39,28.2 v75.21,28.2 | 76.81,19.9 77.69,19.9 U5.11 | 76.81,19.9 71.31,19.9 69.56,18.15 R29.2 | v76.81,18.27 76.81,19.9 | 76.81,4.9 74.94,4.9 C11.2 | 76.81,4.9 78.94,4.9 C13.1 79.06,4.77 C10.2 84.44,4.65 84.69,4.4 89.19,4.4 C29.2 | v72.94,7.9 70.44,5.4 69.44,5.4 69.19,5.65 69.19,6.15 D3.2 | v76.81,4.52 76.81,4.9 | R26.2 95.44,24.52 95.44,25.52 98.94,29.02 98.94,29.52 R30.2 99.06,29.65 99.06,30.4 v99.44,30.77 | v91.81,38.65 91.81,38.52 91.88,38.46 | 45.31,19.27 39.94,19.27 39.25,19.96 | 45.31,19.27 45.94,19.27 46.44,19.77 46.44,19.9 47.56,21.02 47.94,21.02 MT2492.2 | 39.25,19.96 38.31,20.9 38.31,24.9 C30.2 | 39.25,19.96 33.19,13.9 SV1.9 | v18.44,24.77 17.81,25.4 17.81,26.9 IP5306.9 | C24.2 24.56,21.02 22.56,23.02 v18.94,23.02 v16.19,20.27 | 10.25,8.71 7.19,11.77 7.19,22.27 5.94,23.52 5.69,23.52 Q8.3 | 10.25,8.71 15.31,13.77 SV1.2
  Bottom 0.2: 11.94,4.27 4.31,4.27 H2.B2,8 | R13.1 40.06,51.15 33.94,51.15 U3.1 33.81,51.15 21.31,51.15 18.81,53.65 PROG.4 | v5.69,41.77 5.69,43.52 R9.2 5.56,43.65 5.19,44.02 v5.19,47.65 | 24.5,30.83 24.56,30.77 24.56,28.02 C23.2 | 24.5,30.83 15.44,39.9 15.44,41.65 SV2.2 | v50.44,34.65 48.81,34.65 R6.1 48.69,34.52 48.44,34.52 43.81,29.9 43.44,29.9 Q5.E 43.31,29.9 40.44,29.9 37.56,32.77 26.44,32.77 24.5,30.83 | v74.69,46.52 75.56,45.65 75.56,42.4 74.56,41.4 Q4.E | v55.31,18.52 53.06,18.52 50.06,15.52 49.06,15.52 45.31,19.27
  pour Bottom: 0.24,0.22 109.64,0.22 109.64,66.02 0.24,66.02
  pour Top: 0.24,0.22 109.64,0.22 109.64,66.02 0.24,66.02
GNSS_ANT
  Top 0.813: EC200_GSM.47 105.07,20.89 106.26,19.7 GPS.1
GSM_ANT
  Top 0.813: EC200_GSM.49 106.08,26.59 GSM_ANT.1 107.59,28.1 GSM.1
GSM_RST  (via drill 0.2)
  Top 0.2: EC200_GSM.20 72.98,5.64 72.98,5.1 69.5,1.62 54.34,1.62 51.84,4.12 51.84,20.72 v52.34,21.22 | 49.79,37.72 D1.1 | v56.54,39.22 56.56,39.2 GSM_RST.2_2 GSM_RST.2_1 | Q2.C 16.98,18.47 21.64,23.12 44.43,23.12 44.83,23.52 48.54,23.52 52.94,27.92 52.94,36.42 51.64,37.72 49.79,37.72 | v50.44,39.22 49.79,38.57 49.79,37.72
  Bottom 0.2: v52.34,21.22 53.64,22.52 53.64,38.22 52.64,39.22 | v56.54,39.22 52.64,39.22 | v50.44,39.22 52.64,39.22
GSM_RST_O
  Top 0.2: R15.1 22.94,13.77 SV1.5
LBV  (via drill 0.2)
  Top 0.4: v49.81,48.52 51.06,48.52 R3.1
  Bottom 0.4: 70.81,56.77 70.81,55.77 BATT.4 | 66.94,60.65 65.94,61.65 BATT.3 | 66.94,60.65 70.81,56.77 | LIPO.1 79.19,60.4 75.69,56.9 70.94,56.9 70.81,56.77 | R10.2 9.94,38.77 9.94,40.9 14.69,45.65 46.94,45.65 v49.81,48.52 49.94,48.65 55.06,48.65 59.94,53.52 59.94,53.65 66.94,60.65
MAIN_CTS  (via drill 0.2)
  Top 0.2: v81.44,27.4 81.56,27.52 81.56,33.02 82.56,34.02 82.56,34.65 EC200_GSM.64
  Bottom 0.2: v81.44,27.4 81.44,25.02 82.56,23.9 U5.4
MAIN_DCD  (via drill 0.2)
  Top 0.2: v82.31,27.9 82.06,28.15 82.06,32.27 83.94,34.15 83.94,34.65 EC200_GSM.63
  Bottom 0.2: v82.31,27.9 82.31,24.9 82.56,24.65 83.44,24.65 U5.3
MAIN_DTR  (via drill 0.2)
  Top 0.2: v72.44,27.4 71.31,28.52 69.56,28.52 69.56,32.9 68.94,33.52 68.94,35.9 71.69,38.65 80.06,38.65 80.06,34.77 EC200_GSM.66
  Bottom 0.2: v72.44,27.4 77.56,27.4 82.31,22.65 83.44,22.65 U5.6
MAIN_RI  (via drill 0.2)
  Top 0.2: 85.31,32.27 v89.56,32.27 | 85.31,32.27 85.31,34.65 EC200_GSM.62 | v85.06,30.15 85.31,30.4 85.31,32.27
  Bottom 0.2: v89.56,32.27 89.56,30.15 R34.1 | v85.06,30.15 83.56,28.65 83.56,25.9 U5.1
MAIN_RTS  (via drill 0.2)
  Top 0.2: v78.56,30.9 78.81,31.15 78.81,31.65 79.31,32.15 81.06,32.15 81.06,34.4 81.31,34.65 EC200_GSM.65
  Bottom 0.2: v78.56,30.9 79.19,30.27 79.19,26.52 82.44,23.27 83.44,23.27 U5.5
MAIN_RXD  (via drill 0.2)
  Top 0.2: v77.64,32.32 77.64,34.58 EC200_GSM.68
  Bottom 0.2: U5.8 85.81,21.29 86.64,22.12 86.64,30.32 84.84,32.12 77.84,32.12 v77.64,32.32
MAIN_TXD  (via drill 0.2)
  Top 0.2: EC200_GSM.67 78.84,34.68 78.84,33.32 v79.24,32.92
  Bottom 0.2: U5.7 85.75,21.94 86.14,22.33 86.14,30.12 84.63,31.62 77.35,31.62 76.94,32.03 76.94,32.61 77.35,33.03 79.14,33.03 v79.24,32.92
MCU_DTR  (via drill 0.2)
  Top 0.2: v94.31,36.65 92.56,38.4 v92.56,51.02 | v78.94,53.02 77.31,54.65 64.31,54.65 61.31,57.65 v53.06,57.65 | v52.06,58.65 48.31,54.9 v48.31,53.9 | v45.56,51.15 44.44,50.02 44.44,40.77 43.69,40.02 v40.06,40.02
  Bottom 0.2: v94.31,36.65 98.19,32.77 98.19,29.02 88.56,19.4 82.56,19.4 79.44,22.52 77.81,22.52 U5.15 | v92.56,51.02 90.19,51.02 89.31,51.9 88.06,51.9 86.69,53.27 79.19,53.27 v78.94,53.02 | v52.06,58.65 v53.06,57.65 | v45.56,51.15 v48.31,53.9 | v40.06,40.02 38.31,41.77 SV2.11
MCU_RXD  (via drill 0.2)
  Top 0.2: v7.06,55.65 4.69,55.65 v4.69,55.77 | v6.44,15.4 12.06,9.77 12.06,8.4 v12.31,8.15
  Bottom 0.2: U5.14 77.56,21.8 64.31,21.8 62.04,19.53 62.04,11.12 63.94,9.22 63.94,8.02 63.44,7.52 62.24,7.52 60.94,6.22 59.84,6.22 57.24,8.82 32.24,8.82 30.66,10.4 SV1.8 30.56,13.9 28.94,15.52 25.19,15.52 24.56,14.9 24.56,13.27 19.44,8.15 v12.31,8.15 | v7.06,55.65 11.56,55.65 13.44,53.77 13.69,53.77 PROG.2 | v4.69,55.77 4.69,55.4 1.94,52.65 1.94,22.02 6.44,17.52 v6.44,15.4
MCU_TXD  (via drill 0.2)
  Top 0.2: v8.06,45.27 8.06,45.4 13.19,45.4 15.06,47.27 15.06,52.52 16.19,53.65 PROG.3 | v8.06,37.77 8.19,37.65 v8.19,33.02 | v29.44,16.02 28.19,14.77 28.19,13.9 SV1.7
  Bottom 0.2: U5.13 64.51,21.29 62.54,19.32 62.54,12.02 64.44,10.12 64.94,10.12 65.54,9.52 65.54,8.42 64.04,6.92 62.64,6.92 61.44,5.72 59.44,5.72 57.14,8.02 29.94,8.02 28.12,9.84 SV1.7 | v8.06,37.77 v8.06,45.27 | v8.19,33.02 8.19,32.52 10.31,30.4 10.31,18.15 11.81,16.65 20.81,16.65 23.31,19.15 26.31,19.15 v29.44,16.02
N$1  (via drill 0.2)
  Top 0.2: Q2.B 16.31,8.18 17.31,9.18 19.49,9.18 19.98,8.69 R15.2 24.1,8.69 v24.64,9.22 | v27.14,9.92 27.27,10.06 R18.2
  Bottom 0.2: v24.64,9.22 26.44,9.22 v27.14,9.92
N$2
  Top 0.2: Q3.B 8.26,10.57 R22.2 11.25,9.82 11.54,9.52 11.54,7.42 10.84,6.72 9.54,6.72 9.14,6.32 9.14,5.83 9.24,5.73 9.24,2.13 9.79,1.58 49.19,1.58 50.64,3.02 50.64,18.51 R21.2
N$3
  Bottom 0.2: C14.1 47.31,24.15 47.31,22.77 47.94,22.15 MT2492.1
N$4  (via drill 0.2)
  Top 0.2: v98.56,60.52 100.56,60.52 PMS.A | v70.81,50.4 v73.31,50.4 | v54.81,34.4 54.56,34.15 54.56,21.77 53.81,21.02 53.81,6.52 54.06,6.27 54.06,5.77 53.56,5.27 v52.56,5.27 | v40.19,6.4 38.81,6.4 38.81,12.27 39.81,13.27 39.81,19.9 40.69,20.77 R4.1
  Bottom 0.2: v98.56,60.52 92.31,54.27 77.19,54.27 v73.31,50.4 | v54.81,34.4 v70.81,50.4 | v52.56,5.27 48.81,5.27 46.94,7.15 40.94,7.15 v40.19,6.4
N$6  (via drill 0.2)
  Top 0.2: v42.69,24.77 38.44,24.77 v38.44,26.4 | v17.19,19.77 16.94,20.02 16.94,21.52 16.44,22.02 16.44,28.15 16.19,28.4 L1.1
  Bottom 0.2: 42.94,24.77 42.94,24.65 45.44,22.15 MT2492.6 | 42.94,24.77 42.94,25.4 43.44,25.9 43.94,25.9 45.56,24.27 46.19,24.27 C14.2 | v42.69,24.77 42.94,24.77 | v38.44,26.4 36.69,26.4 31.69,21.4 27.44,21.4 25.81,19.77 v17.19,19.77
N$9
  Bottom 0.2: DW01.1 7.94,31.52 8.31,31.52 9.06,30.77 9.06,22.27 8.56,21.77 8.19,21.77 Q8.6
N$10  (via drill 0.2)
  Top 0.2: v63.31,12.27 60.69,12.27 v60.69,12.15 | v56.81,9.77 v58.81,9.77 | v49.81,9.77 50.06,10.02 50.06,18.02 v49.69,18.4 | v47.44,25.27 v47.44,29.4
  Bottom 0.2: R6.2 48.69,32.9 48.69,29.52 R1.1 48.56,29.4 v47.44,29.4 | v63.31,12.27 64.44,11.15 68.31,11.15 C21.2 | v60.69,12.15 60.69,11.65 v58.81,9.77 | v49.81,9.77 v56.81,9.77 | 48.88,19.21 48.06,20.02 MT2492.3 | 48.88,19.21 v49.69,18.4 | v47.44,25.27 48.06,24.65 48.06,23.4 48.94,22.52 48.94,19.27 48.88,19.21
N$11
  Bottom 0.2: R7.1 40.56,20.15 45.44,20.15 MT2492.4
N$13
  Bottom 0.2: R17.1 30.56,24.77 24.81,24.77 24.69,24.9 C23.1
N$14  (via drill 0.2)
  Top 0.2: 25%.C 2.69,25.9 2.69,28.77 50%.A 2.69,28.9 2.69,29.52 | 2.69,29.52 2.69,31.9 75%.C 2.69,32.02 2.69,35.27 100%.A | v22.56,25.02 23.31,25.77 23.31,32.02 22.81,32.52 21.31,32.52 21.31,27.9 18.94,25.52 17.19,25.52 v17.19,23.52 | v13.44,23.9 11.81,23.9 6.19,29.52 2.69,29.52
  Bottom 0.2: v22.56,25.02 IP5306.4 | v17.19,23.52 13.81,23.52 v13.44,23.9
N$17  (via drill 0.2)
  Top 0.2: 50%.C 4.19,28.77 4.19,25.9 25%.A 4.19,25.77 9.19,25.77 11.81,23.15 13.69,23.15 13.81,23.27 15.06,23.27 15.44,22.9 15.44,22.52 v15.69,22.27 | v21.81,26.9 19.69,24.77 19.69,22.77 19.19,22.27 v17.19,22.27
  Bottom 0.2: v21.81,26.9 21.19,27.52 20.44,27.52 IP5306.2 | v15.69,22.27 v17.19,22.27
N$18  (via drill 0.2)
  Top 0.2: 100%.C 4.19,35.27 4.19,32.02 75%.A 4.31,31.9 4.31,31.77 8.06,31.77 12.81,36.52 12.81,37.15 v17.19,37.15 | v21.94,25.77 22.56,26.4 v22.56,31.77
  Bottom 0.2: v21.94,25.77 21.44,26.27 20.44,26.27 IP5306.3 | v17.19,37.15 v22.56,31.77
N$19
  Bottom 0.2: DW01.3 7.94,29.65 7.94,23.77 8.06,23.65 Q8.4
N$20
  Top 0.2: CHARGER.1_2 CHARGER.1_1
  Top 0.4: CHARGER.1_2 9.37,22.06 R37.1
N$21  (via drill 0.2)
  Top 0.2: v11.81,27.65 11.06,28.4 11.06,34.02 13.44,36.4 31.44,36.4 31.44,33.65 L2.1
  Bottom 0.2: v11.81,27.65 15.06,27.65 IP5306.7
N$22  (via drill 0.2)
  Top 0.2: v46.94,48.4 v46.94,40.27
  Bottom 0.2: 46.94,49.52 47.19,49.52 R12.2 46.94,49.52 | 46.94,49.52 40.19,49.52 R13.2 | v46.94,40.27 46.94,33.77 44.94,31.77 43.44,31.77 Q5.B | 46.94,49.52 v46.94,48.4
N$24  (via drill 0.2)
  Top 0.2: v26.44,16.77 v32.69,16.77
  Bottom 0.2: v32.69,16.77 32.69,17.9 R19.1 | v26.44,16.77 26.19,16.77 25.06,17.9 24.69,17.9 C24.1
N$25
  Top 0.2: PO.A 13.81,60.65 9.94,60.65 R14.1
N$26  (via drill 0.2)
  Top 0.2: v57.19,34.27 56.94,34.02 56.94,13.65 56.06,12.77 56.06,9.52 56.56,9.02 v59.44,9.02
  Bottom 0.2: R23.2 83.44,36.9 80.06,36.9 R24.2 79.94,36.77 79.69,36.52 72.94,36.52 61.44,25.02 61.44,11.4 59.44,9.4 v59.44,9.02 | v57.19,34.27 66.44,43.52 71.44,43.52 71.81,43.15 74.44,43.15 Q4.B
N$27
  Top 0.2: DHT.A 11.76,5.52 13.04,5.52 R16.1
N$28  (via drill 0.2)
  Top 0.2: R31.2 45.19,8.02 40.81,8.02 R32.2 40.69,7.9 40.69,7.15 v39.56,7.15 | v37.06,6.65 37.06,7.27 36.56,7.77 Q6.B
  Bottom 0.2: v37.06,6.65 39.06,6.65 v39.56,7.15
N$29
  Bottom 0.2: R25.1 67.06,42.65 69.81,42.65 70.19,43.02 71.19,43.02 72.06,42.15 72.31,42.15 Q4.C
N$30  (via drill 0.2)
  Top 0.2: v48.31,10.52 48.31,4.65 48.44,4.52 NMDE.C
  Bottom 0.2: v48.31,10.52 56.31,18.52 56.31,31.52 65.69,40.9 66.94,40.9 R25.2
N$31  (via drill 0.2)
  Top 0.2: v93.94,21.4 92.44,19.9 92.44,10.27 91.19,9.02 88.19,9.02 88.19,22.52 v88.06,22.65
  Bottom 0.2: 88.38,22.33 86.06,20.02 83.56,20.02 U5.10 | 88.38,22.33 88.69,22.65 89.19,22.65 R27.2 | v93.94,21.4 95.31,22.77 R26.1 | 88.38,22.33 v88.06,22.65
N$32
  Top 0.2: Q6.C 30.25,4.74 R33.1
N$33
  Bottom 0.2: R28.1 41.31,35.9 41.31,30.9 Q5.C
N$34  (via drill 0.2)
  Top 0.2: v50.69,23.02 50.69,22.02 48.19,22.02 47.44,21.27 47.44,4.52 43.31,4.52 NST.C | v46.06,33.9 v50.69,29.27
  Bottom 0.2: v50.69,29.27 v50.69,23.02 | v46.06,33.9 45.19,33.9 43.19,35.9 R28.2
N$35  (via drill 0.2)
  Top 0.2: v35.31,54.65 31.06,58.9 PWR_ON.A | v57.56,53.4 59.69,55.52 60.44,55.52 R2.2
  Bottom 0.2: v35.31,54.65 49.94,54.65 51.19,53.4 v57.56,53.4
N$37  (via drill 0.2)
  Top 0.2: v6.56,37.02 v2.81,37.02
  Bottom 0.2: v2.81,37.02 3.94,37.02 C4.1 | R10.1 9.81,37.02 v6.56,37.02 6.44,36.9 6.44,31.4 5.69,30.65 5.31,30.65 DW01.5
N$39
  Top 0.2: R33.2 31.46,3.04 32.93,4.51 PST.C
N$40
  Bottom 0.2: R30.1 97.19,29.52 96.69,29.52 91.94,24.77 90.44,24.77 89.94,25.27 88.56,25.27 87.19,23.9 87.19,21.9 85.94,20.65 83.56,20.65 U5.9
N$41
  Bottom 0.2: R29.1 71.31,18.02 76.06,18.02 76.56,17.52 77.06,17.52 78.81,19.27 78.81,20.27 78.56,20.52 77.81,20.52 U5.12
N$42  (via drill 0.2)
  Top 0.2: v93.06,32.65 v91.69,31.27
  Bottom 0.2: v91.69,31.27 91.31,30.9 91.31,30.15 R34.2 | v93.06,32.65 93.06,37.4 R35.2 93.19,37.4 94.56,37.4 95.31,36.65 99.94,36.65 Q7.B
N$43
  Bottom 0.2: R36.1 101.94,34.15 101.94,37.4 102.06,37.52 Q7.C
N$44  (via drill 0.2)
  Top 0.2: v42.19,4.4 38.81,4.4 MRI.C | v69.19,2.4 v62.44,2.4
  Bottom 0.2: v42.19,4.4 47.94,4.4 50.69,1.65 61.69,1.65 v62.44,2.4 | v69.19,2.4 89.81,2.4 100.44,13.02 100.44,33.77 100.19,34.02 R36.2
N$45  (via drill 0.2)
  Top 0.2: v13.81,22.4 13.81,22.36
  Top 0.4: R37.2 13.81,22.36
  Bottom 0.2: 13.88,22.46 12.69,23.65 12.69,24.15 13.44,24.9 15.06,24.9 IP5306.5 | 13.88,22.46 14.44,21.9 14.44,18.02 R20.2 | v13.81,22.4 13.88,22.46
N$46  (via drill 0.2)
  Top 0.2: v28.56,65.65 51.56,65.65 55.56,61.65 55.56,59.02 61.44,59.02 61.94,59.52 61.94,60.65 62.06,60.77 CHARGING.A | v5.31,17.65 6.56,17.65 6.69,17.52 v11.94,17.52
  Bottom 0.2: v28.56,65.65 13.94,65.65 4.81,56.52 4.44,56.52 1.19,53.27 1.19,21.77 v5.31,17.65 | v11.94,17.52 13.44,17.52 13.81,17.15 15.44,17.15 16.19,17.9 R20.1
N$47  (via drill 0.2)
  Top 0.2: v4.06,40.52 7.31,37.27 v7.31,32.52
  Bottom 0.2: v4.06,40.52 4.06,43.52 R9.1 | v7.31,32.52 6.94,32.15 6.94,31.15 7.44,30.65 7.81,30.65 DW01.2
N$59  (via drill 0.2)
  Top 0.305: PB_IN.1 22.62,58.04 23.34,57.32
  Top 0.4: 23.34,57.32 v27.24,57.32
  Bottom 0.4: v27.24,57.32 29.78,57.32 D4.2
N$60
  Top 0.2: J3.2 52.94,61.02 48.31,61.02 48.31,58.15 J3.3
  Bottom 0.2: D7.1 60.19,61.52 53.94,61.52 J3.2
N$61
  Bottom 0.2: D6.2 45.06,60.52 47.56,60.52 47.69,60.65 48.94,60.65 52.94,56.65 52.94,55.15 J3.1
NET_MODE  (via drill 0.2)
  Top 0.2: v64.19,26.77 65.19,27.77 66.06,27.77 EC200_GSM.5
  Bottom 0.2: v64.19,26.77 73.44,36.02 81.31,36.02 82.06,35.27 83.44,35.27 R23.1
NETSTAT  (via drill 0.2)
  Top 0.2: v49.81,53.77 50.06,54.02 50.06,55.65 52.94,58.52 63.19,58.52 v63.19,60.4 | v92.06,55.02 91.81,54.77 91.81,43.52 88.44,40.15 70.56,40.15 70.56,38.27 67.69,35.4 67.69,27.65 66.69,26.65 66.19,26.65 EC200_GSM.6
  Bottom 0.2: v49.81,53.77 47.31,51.27 R12.1 | v63.19,60.4 65.56,62.77 71.69,62.77 75.19,59.27 77.19,59.27 78.19,60.27 78.19,60.9 79.19,61.9 85.19,61.9 v92.06,55.02
PMS_LED
  Top 0.2: SV1.12 40.82,19.09 R4.2
PMS_RX
  Top 0.2: J2.5 90.06,43.75 87.84,41.52 56.74,41.52 53.54,38.32 53.54,27.62 48.94,23.02 45.04,23.02 43.36,21.34 SV1.13
PMS_TX
  Top 0.2: J2.4 91.31,43.79 88.55,41.02 56.95,41.02 54.04,38.12 54.04,27.42 49.15,22.52 45.34,22.52 43.94,21.12 43.94,15.76 SV1.14
PWRKEY  (via drill 0.2)
  Top 0.2: EC200_GSM.21 74.18,5.54 74.18,5.14 70.06,1.02 51.44,1.02 | 51.44,1.02 9.64,1.02 8.74,1.92 8.74,5.52 5.64,8.62 3.14,8.62 2.94,8.42 2.04,8.42 1.24,9.22 1.24,10.13 Q3.C | v53.44,3.52 59.94,3.52 C1.1 | 51.44,1.02 v51.44,3.52
  Bottom 0.2: v51.44,3.52 v53.44,3.52
PWRKEY_0
  Top 0.2: SV1.15 48.44,19.02 R21.1
PWRSTAT  (via drill 0.2)
  Top 0.2: v46.69,6.4 46.69,8.27 45.31,9.65 R31.1 | v88.56,36.4 86.69,36.4 86.69,34.77 EC200_GSM.61
  Bottom 0.2: v46.69,6.4 46.94,6.4 51.19,2.15 61.19,2.15 62.19,3.15 65.44,3.15 66.94,1.65 89.81,1.65 101.06,12.9 101.06,37.27 100.81,37.52 95.19,37.52 94.44,38.27 92.44,38.27 91.81,37.65 91.81,36.27 90.94,35.4 89.56,35.4 v88.56,36.4
SIMCLK  (via drill 0.2)
  Top 0.2: SIMCARD.C3 82.89,42.23 77.56,42.23 | 77.56,42.23 v70.44,42.23 | v56.84,12.52 58.87,10.49 EC200_GSM.16 66.19,10.4 66.81,10.4 67.69,9.52 v67.69,7.02 | 77.56,42.23 v77.56,49.4
  Bottom 0.2: v70.44,42.23 68.04,39.82 65.33,39.82 56.84,31.33 v56.84,12.52 | v67.69,7.02 68.44,6.27 D3.3 | v77.56,49.4 77.94,49.4 80.81,52.27 86.19,52.27 95.19,43.27 103.81,43.27 C16.1
SIMDATA  (via drill 0.2)
  Top 0.2: 64.31,11.44 10K.1 59.72,11.44 57.44,13.72 57.44,30.32 64.34,37.22 64.34,38.32 66.04,40.03 v69.74,40.03 | 64.31,11.44 65.73,11.44 EC200_GSM.15 | v86.24,44.82 86.13,44.72 SIMCARD.C7 84.06,44.77 83.56,44.77 v77.94,50.4 | 64.31,11.44 v64.31,12.27
  Bottom 0.2: v86.24,44.82 86.64,44.42 86.64,43.32 84.44,41.12 76.93,41.12 75.83,40.03 v69.74,40.03 | v64.31,12.27 69.31,12.27 70.06,11.52 70.06,10.77 68.56,9.27 68.56,8.02 D3.4 | v77.94,50.4 80.31,52.77 86.44,52.77 88.94,50.27 103.44,50.27 C15.1
SIMRST  (via drill 0.2)
  Top 0.2: SIMCARD.C2 88.4,45.99 v88.44,46.02 | v60.14,7.12 61.54,7.12 62.62,8.2 C17.1 | v70.69,8.15 68.44,8.15 68.44,6.77 67.94,6.27 64.44,6.27 64.44,9.19
  Top 0.6: EC200_GSM.17 64.44,9.19 62.7,9.19 C17.1
  Bottom 0.2: v88.44,46.02 88.44,44.32 84.74,40.62 77.14,40.62 75.84,39.32 65.54,39.32 58.04,31.82 58.04,9.22 v60.14,7.12 | v70.69,8.15 70.69,7.77 70.19,7.27 69.44,7.27 69.19,7.52 69.19,7.9 D3.5
USIM_DET  (via drill 0.2)
  Top 0.2: 51K.1 61.79,20.55 60.89,19.65 60.89,18.48 61.07,18.3 62.66,18.3 63.64,17.32 63.64,15.72 64.39,14.97 | 64.39,14.97 64.97,14.39 EC200_GSM.13 | v64.44,15.02 64.39,14.97
  Bottom 0.2: v64.44,15.02 67.31,15.02 70.56,11.77 70.56,10.52 69.81,9.77 69.81,8.02 D3.6
USIM_GND
  Top 0.2: C18.1 63.1,19.06 63.87,18.29 EC200_GSM.10
USIM_VDD  (via drill 0.2)
  Top 0.2: SIMCARD.C1 84.75,47.88 87.57,47.88 89.14,46.31 89.14,45.73 89.04,45.63 89.04,43.93 v88.29,43.18 | C18.2 61.68,16.46 v59.74,14.52 60.59,14.52 10K.2 65.52,13.14 65.57,13.09 EC200_GSM.14 66.19,13.02 66.19,12.52 71.19,12.52 71.56,12.15 71.56,8.27 v71.81,8.02
  Bottom 0.2: v88.29,43.18 85.23,40.12 77.35,40.12 76.05,38.82 65.75,38.82 58.64,31.72 58.64,15.12 59.24,14.52 v59.74,14.52 | v71.81,8.02 70.06,6.27 69.81,6.27 D3.1
V_LIPO  (via drill 0.2)
  Top 0.4: v37.81,9.65 37.94,9.52 37.94,5.15 37.81,5.02 37.81,3.01 | v22.94,23.9 26.56,27.52 31.44,27.52 L2.2 31.56,27.4 31.56,23.77 36.69,23.77 37.56,24.65 37.56,27.9 42.81,33.15 C12.1 | v28.19,22.4 v29.94,20.65 | BATT.5 68.44,55.77 68.44,61.65 BATT.2 | v75.69,46.77 75.69,44.4 C9.+ | EC200_GSM.58 90.56,34.77 91.69,34.77 EC200_GSM.57 | v87.19,33.02 87.81,33.65 87.81,34.65 EC200_GSM.60 88.06,34.77 89.06,34.77 EC200_GSM.59 89.31,34.77 90.31,34.77 EC200_GSM.58 | v85.06,12.27 84.94,12.4 84.94,12.52 83.69,13.77 72.19,13.77 v72.19,22.9 | v90.69,38.27 90.69,34.9 EC200_GSM.58 | v54.56,17.77 54.44,17.9 54.44,19.4 v55.06,20.02
  Top 0.6: PST.A 37.81,3.01 38.71,3.01 MRI.A 43.2,3 NST.A 48.44,2.98 NMDE.A
  Bottom 0.4: 31.81,18.77 32.69,19.65 R19.2 | 31.81,18.77 31.81,11.15 33.31,9.65 v37.81,9.65 37.94,9.77 46.31,9.77 48.56,12.02 48.94,12.02 54.56,17.65 v54.56,17.77 | IP5306.6 15.19,26.27 15.69,26.27 18.06,23.9 v22.94,23.9 24.44,22.4 v28.19,22.4 | v29.94,20.65 31.81,18.77 | 72.06,50.4 68.44,54.02 68.44,55.65 BATT.5 | 72.06,50.4 v75.69,46.77 75.81,46.9 76.31,46.9 81.06,51.65 85.94,51.65 90.69,46.9 v90.69,38.27 | C11.1 74.94,6.4 78.94,6.4 C13.2 79.19,6.52 84.31,6.52 C10.1 84.44,6.65 84.94,7.15 85.06,7.15 | 85.06,7.15 89.19,7.15 C29.1 | v87.19,33.02 86.44,33.77 77.19,33.77 71.56,28.15 71.56,24.15 D2.1 71.69,24.02 72.19,23.52 v72.19,22.9 | v85.06,12.27 85.06,7.15 | v55.06,20.02 55.69,20.65 55.69,34.02 72.06,50.4
VDD_EXT  (via drill 0.2)
  Top 0.2: 51K.2 64.31,25.31 | 64.31,25.31 66.06,25.31 EC200_GSM.7 | v92.69,31.27 91.69,30.27 91.69,27.15 | 91.69,27.15 v91.69,24.02 v91.69,17.02 | v85.06,25.27 85.44,25.65 85.44,26.9 85.69,27.15 91.69,27.15 | v64.31,20.02 64.31,25.31
  Bottom 0.2: v92.69,31.27 87.44,36.52 87.19,36.52 C19.2 | v91.69,24.02 89.69,24.02 89.31,24.4 R27.1 | v85.06,25.27 83.56,25.27 U5.2 | v64.31,20.02 66.06,20.02 69.06,17.02 v91.69,17.02
VUSB
  Bottom 0.4: 44.76,56.29 44.19,56.4 41.31,56.4 PWR.6 | PWR.1 35.31,61.27 39.81,61.27 41.19,59.9 41.81,59.9 44.69,57.02 D6.1
  Bottom 1.27: D6.1 44.76,56.29
(copper drawn outside any net)
  shapes: Top area x1

## Text on the board
tPlace: - | + | - | + | BATTERY LEVEL
tNames: 1.8V | 2.8V | DHT22